# Altium schematic sheet Sheet1.SchDoc
size A; SheetNumber: 1; SheetTotal: 1
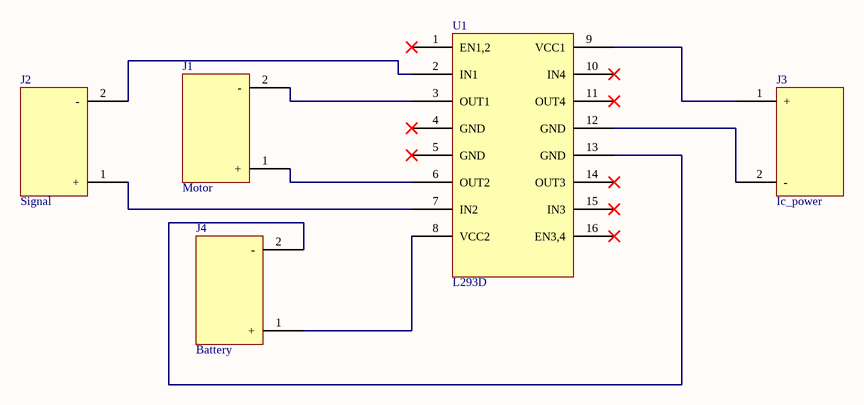
[diagram p0: Sheet1.SchDoc]

## Parts
J1  Motor  [HEAD]
J2  Signal  [HEAD]
J3  Ic_power  [HEAD]
J4  Battery  [HEAD]
U1  L293D  [L293d]

## Nets
NetJ1_1: J1.1(+) U1.6(OUT2)
NetJ1_2: J1.2(-) U1.3(OUT1)
NetJ2_1: J2.1(+) U1.7(IN2)
NetJ2_2: J2.2(-) U1.2(IN1)
NetJ3_1: J3.1(+) U1.9(VCC1)
NetJ3_2: J3.2(-) U1.12(GND)
NetJ4_1: J4.1(+) U1.8(VCC2)
NetJ4_2: J4.2(-) U1.13(GND)

Not connected (* = marked no-connect by the designer): U1 1(EN1,2)* 4(GND)* 5(GND)* 10(IN4)* 11(OUT4)* 14(OUT3)* 15(IN3)* 16(EN3,4)*

## Library data of the parts
J1-J4 = PPPC021LFBN-RC: Board Connector, 2 Contact(s), 1 Row(s), Female, Straight, 0.1 inch Pitch, Solder Terminal, Locking; Manufacturer: Sullins; Manufacturer Series: PP; Contact Pattern: RECTANGULAR; Contact Style: SQ PIN-SKT; Number Of Connectors: 1; Polarization Key: POLARIZED HOUSING; Rated Current (Signal): 3A; Number of Contacts: 2; Body Breadth: 0.094inch; Body Depth: 0.334inch; Body Length: 0.22inch; Reference Standard: UL; Reliability: COMMERCIAL; Supplier: Digikey; Supplier Part Number: S7035-ND; Manufacturer Part Number: PPPC021LFBN-RC; RoHS: Yes; Category: Connectors; Stock: 20345; Pricing: 1=0.34, 10=0.287, 100=0.223, 500=0.1911, 1000=0.15925, 5000=0.1365, 10000=0.13 (USD); Mounting Technology: Board; Contact Material: Bronze; Contact Finish - Mating: AU; Insulation Material: Polyester; Connector Type: BOARD CONNECTOR; Contact Gender: Female; Mounting Style: STRAIGHT; Number Of PCB Rows: 1; Number of Rows Loaded: 1; PCB Contact Pattern: RECTANGULAR; Termination: Solder; Mating Contact Pitch: 0.1inch; Mounting Option 1: LOCKING; Terminal Length: 0.125inch; Terminal Pitch: 2.54mm; Reach SVHC Compliant: Yes; RoHS Compliant: Yes; ComponentLink1URL: https://datasheet.ciiva.com:443/pdfs/VipMasterIC/IC/SUCS/SUCSS00270/SUCSS00270-1.pdf?src-supplier=IHS+Markit; ComponentLink1Description: https://datasheet.ciiva.com:443/pdfs/VipMasterIC/IC/SUCS/SUCSS00270/SUCSS00270-1.pdf?src-supplier=IHS+Markit; ComponentLink2URL: https://media.digikey.com/pdf/Data%20Sheets/Sullins%20PDFs/Female_Headers.100_DS.pdf?src-supplier=Digikey; ComponentLink2Description: https://media.digikey.com/pdf/Data%20Sheets/Sullins%20PDFs/Female_Headers.100_DS.pdf?src-supplier=Digikey; ComponentLink3URL: http://www.sullinscorp.com/catalogs/78_Page80-81_HEADER_.100_2.54mm_FEMALE.pdf?src-supplier=Future+Electronics; ComponentLink3Description: http://www.sullinscorp.com/catalogs/78_Page80-81_HEADER_.100_2.54mm_FEMALE.pdf?src-supplier=Future+Electronics; ComponentLink4URL: https://datasheet.octopart.com/PPPC021LFBN-RC-Sullins-datasheet-41308905.pdf?src-supplier=Future+Electronics; ComponentLink4Description: https://datasheet.octopart.com/PPPC021LFBN-RC-Sullins-datasheet-41308905.pdf?src-supplier=Future+Electronics
U1 = L293D: Half Bridge Based Peripheral Driver, 1.2A, PDIP16; Manufacturer: STMicroelectronics; Package Body Material: Plastic; Built-in Protections: TRANSIENT,THERMAL; Channels: 2; Output Current Flow Direction: SOURCE AND SINK; Max Supply Voltage: 36V; Nominal Supply Voltage: 5V; Surface Mount: No; Supply Voltage1-Min: 4.5V; Supply Voltage1-Nom: 24V; Output Polarity: True; Input Characteristics: STANDARD; Output Characteristics: 3-STATE; Qualification Status: Not Qualified; Supplier: Future Electronics; Supplier Part Number: 2116481; Manufacturer Part Number: L293D; RoHS: Yes; Category: Motor Drivers; Stock: 1325; Pricing: 25=4.14, 100=4.02, 375=3.9, 625=3.85, 1250=3.71 (USD); Case/Package: DIP; Pins: 16; Package Shape: Rectangular; Terminal Finish: Tin; JESD-609 Code: e3; Interface IC Type: HALF BRIDGE BASED PERIPHERAL DRIVER; JESD-30 Code: R-PDIP-T16; Package Style: IN-LINEMeter; Terminal Form: Through Hole; Terminal Position: DUAL; Output Peak Current Limit-Nom: 1.2A; Supply Voltage1-Max: 36V; Min Supply Voltage: 4.5V; Length: 20mm; Width: 7.62mm; Height - Seated (Max): 5.1mm; Terminal Pitch: 2.54mm; RoHS Compliant: Yes; Reach SVHC Compliant: No; ComponentLink1URL: https://datasheet.ciiva.com:443/pdfs/VipMasterIC/IC/SGST/SGSTS19357/SGSTS19357-1.pdf?src-supplier=IHS+Markit; ComponentLink1Description: https://datasheet.ciiva.com:443/pdfs/VipMasterIC/IC/SGST/SGSTS19357/SGSTS19357-1.pdf?src-supplier=IHS+Markit; ComponentLink2URL: https://datasheet.ciiva.com/14150/ocl293d-647107-dat-en-14150297.pdf?src-supplier=Distrelec; ComponentLink2Description: https://datasheet.ciiva.com/14150/ocl293d-647107-dat-en-14150297.pdf?src-supplier=Distrelec; ComponentLink3URL: https://datasheet.ciiva.com/15109/getdatasheetpartid-121660-15109379.pdf?src-supplier=Verical; ComponentLink3Description: https://datasheet.ciiva.com/15109/getdatasheetpartid-121660-15109379.pdf?src-supplier=Verical; ComponentLink4URL: https://datasheet.ciiva.com/29307/156134-da-01-en-4-kanal-treiber-ic-l293d-stm-29307000.pdf?src-supplier=Conrad; ComponentLink4Description: https://datasheet.ciiva.com/29307/156134-da-01-en-4-kanal-treiber-ic-l293d-stm-29307000.pdf?src-supplier=Conrad; ComponentLink5URL: https://datasheet.ciiva.com/1955/cd00000059-1955400.pdf?src-supplier=Digikey; ComponentLink5Description: https://datasheet.ciiva.com/1955/cd00000059-1955400.pdf?src-supplier=Digikey; ComponentLink6URL: https://datasheet.ciiva.com/4895/cd00000059-4895945.pdf?src-supplier=Mouser; ComponentLink6Description: https://datasheet.ciiva.com/4895/cd00000059-4895945.pdf?src-supplier=Mouser; ComponentLink7URL: https://datasheet.ciiva.com/16458/cd00000059-16458220.pdf?src-supplier=Future+Electronics; ComponentLink7Description: https://datasheet.ciiva.com/16458/cd00000059-16458220.pdf?src-supplier=Future+Electronics